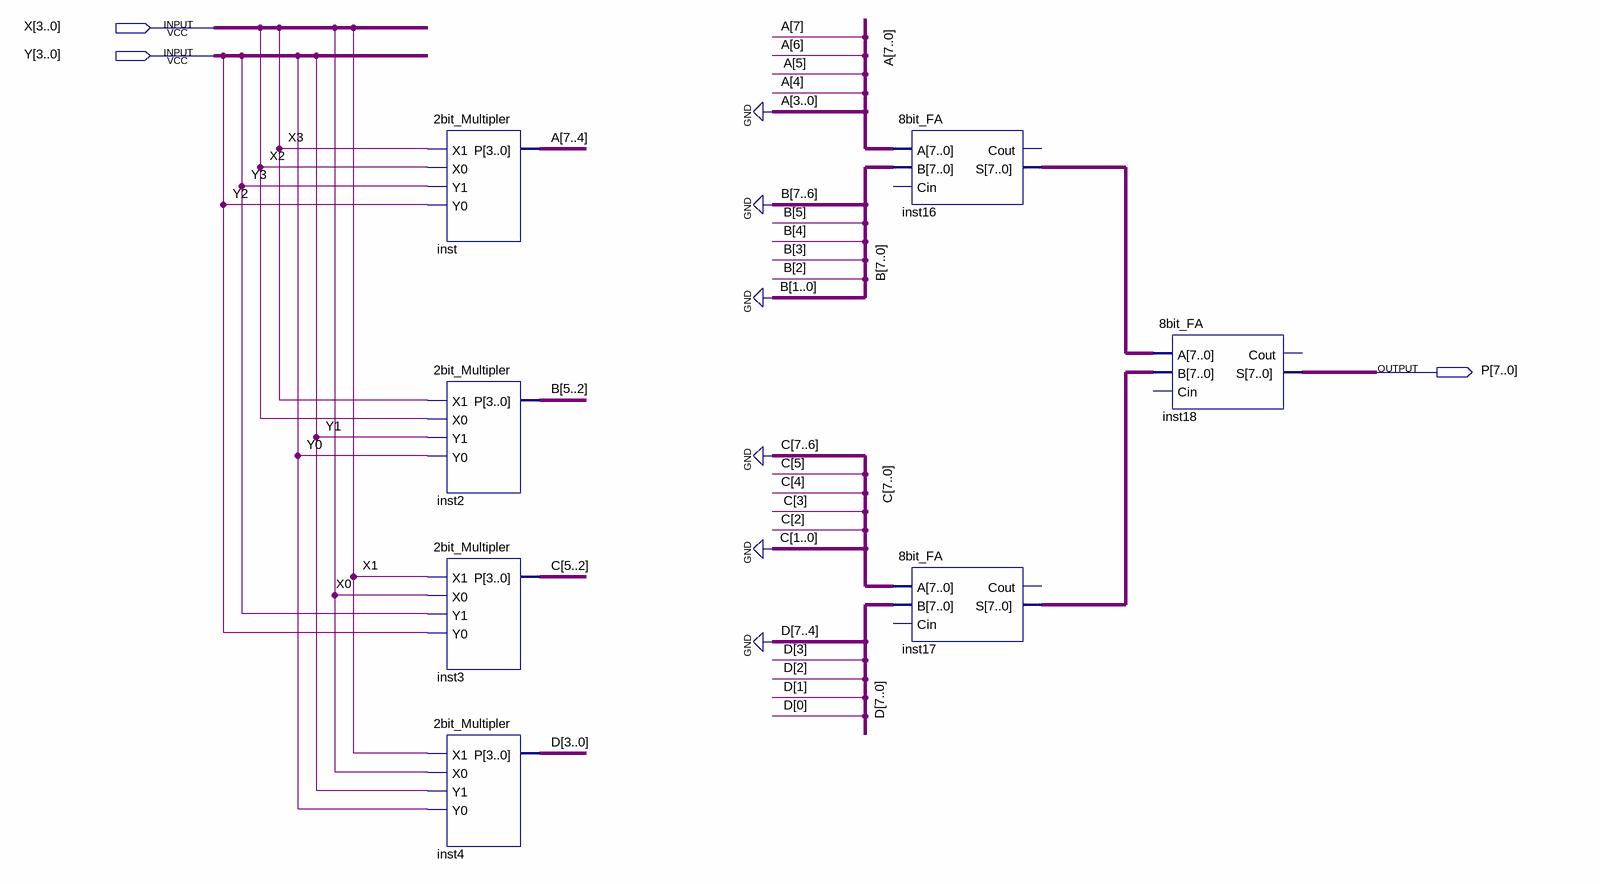
[diagram p0: schematic sheet]
// Quartus schematic 4bit_Multipler.bdf as structural Verilog: 7 symbols, 3 pins
module \4bit_Multipler  (
  input  [3:0] X,
  input  [3:0] Y,
  output [7:0] P
);

  wire [3:0] D;
  wire [5:2] B, C;
  wire [7:0] inst16_s, inst17_s;
  wire [7:4] A;

  \2bit_Multipler  inst (.X1(X[3]), .X0(X[2]), .Y1(Y[3]), .Y0(Y[2]), .P(A));
  \2bit_Multipler  inst2 (.X1(X[3]), .X0(X[2]), .Y1(Y[1]), .Y0(Y[0]), .P(B));
  \2bit_Multipler  inst3 (.X1(X[1]), .X0(X[0]), .Y1(Y[3]), .Y0(Y[2]), .P(C));
  \2bit_Multipler  inst4 (.X1(X[1]), .X0(X[0]), .Y1(Y[1]), .Y0(Y[0]), .P(D));
  \8bit_FA  inst16 (.A({A, 4'b0000}), .B({2'b00, B, 2'b00}), .S(inst16_s));  // open: Cin, Cout
  \8bit_FA  inst17 (.A({2'b00, C, 2'b00}), .B({4'b0000, D}), .S(inst17_s));  // open: Cin, Cout
  \8bit_FA  inst18 (.A(inst16_s), .B(inst17_s), .S(P));  // open: Cin, Cout
endmodule
